# EasyEDA Pro project ProPrj_Thunder F722 Final_2024-11-16.epro, schematic Thunder F722 PCBA Low Cost
Board Name: Thunder F722 PCBA Low Cost; Create Date: 2024-11-16; Page Name: SCH_GIT_FULL; Project Name: Thunder F722 Final; Schematic Name: Thunder F722 PCBA Low Cost; Update Date: 2024-11-16; Add into BOM: yes; Company: TROPICAL FPV; Convert to PCB: yes; Date: 2024-11-15; Draw By: ALESSANDRO; REV: 1.2; Sheet: 1/1
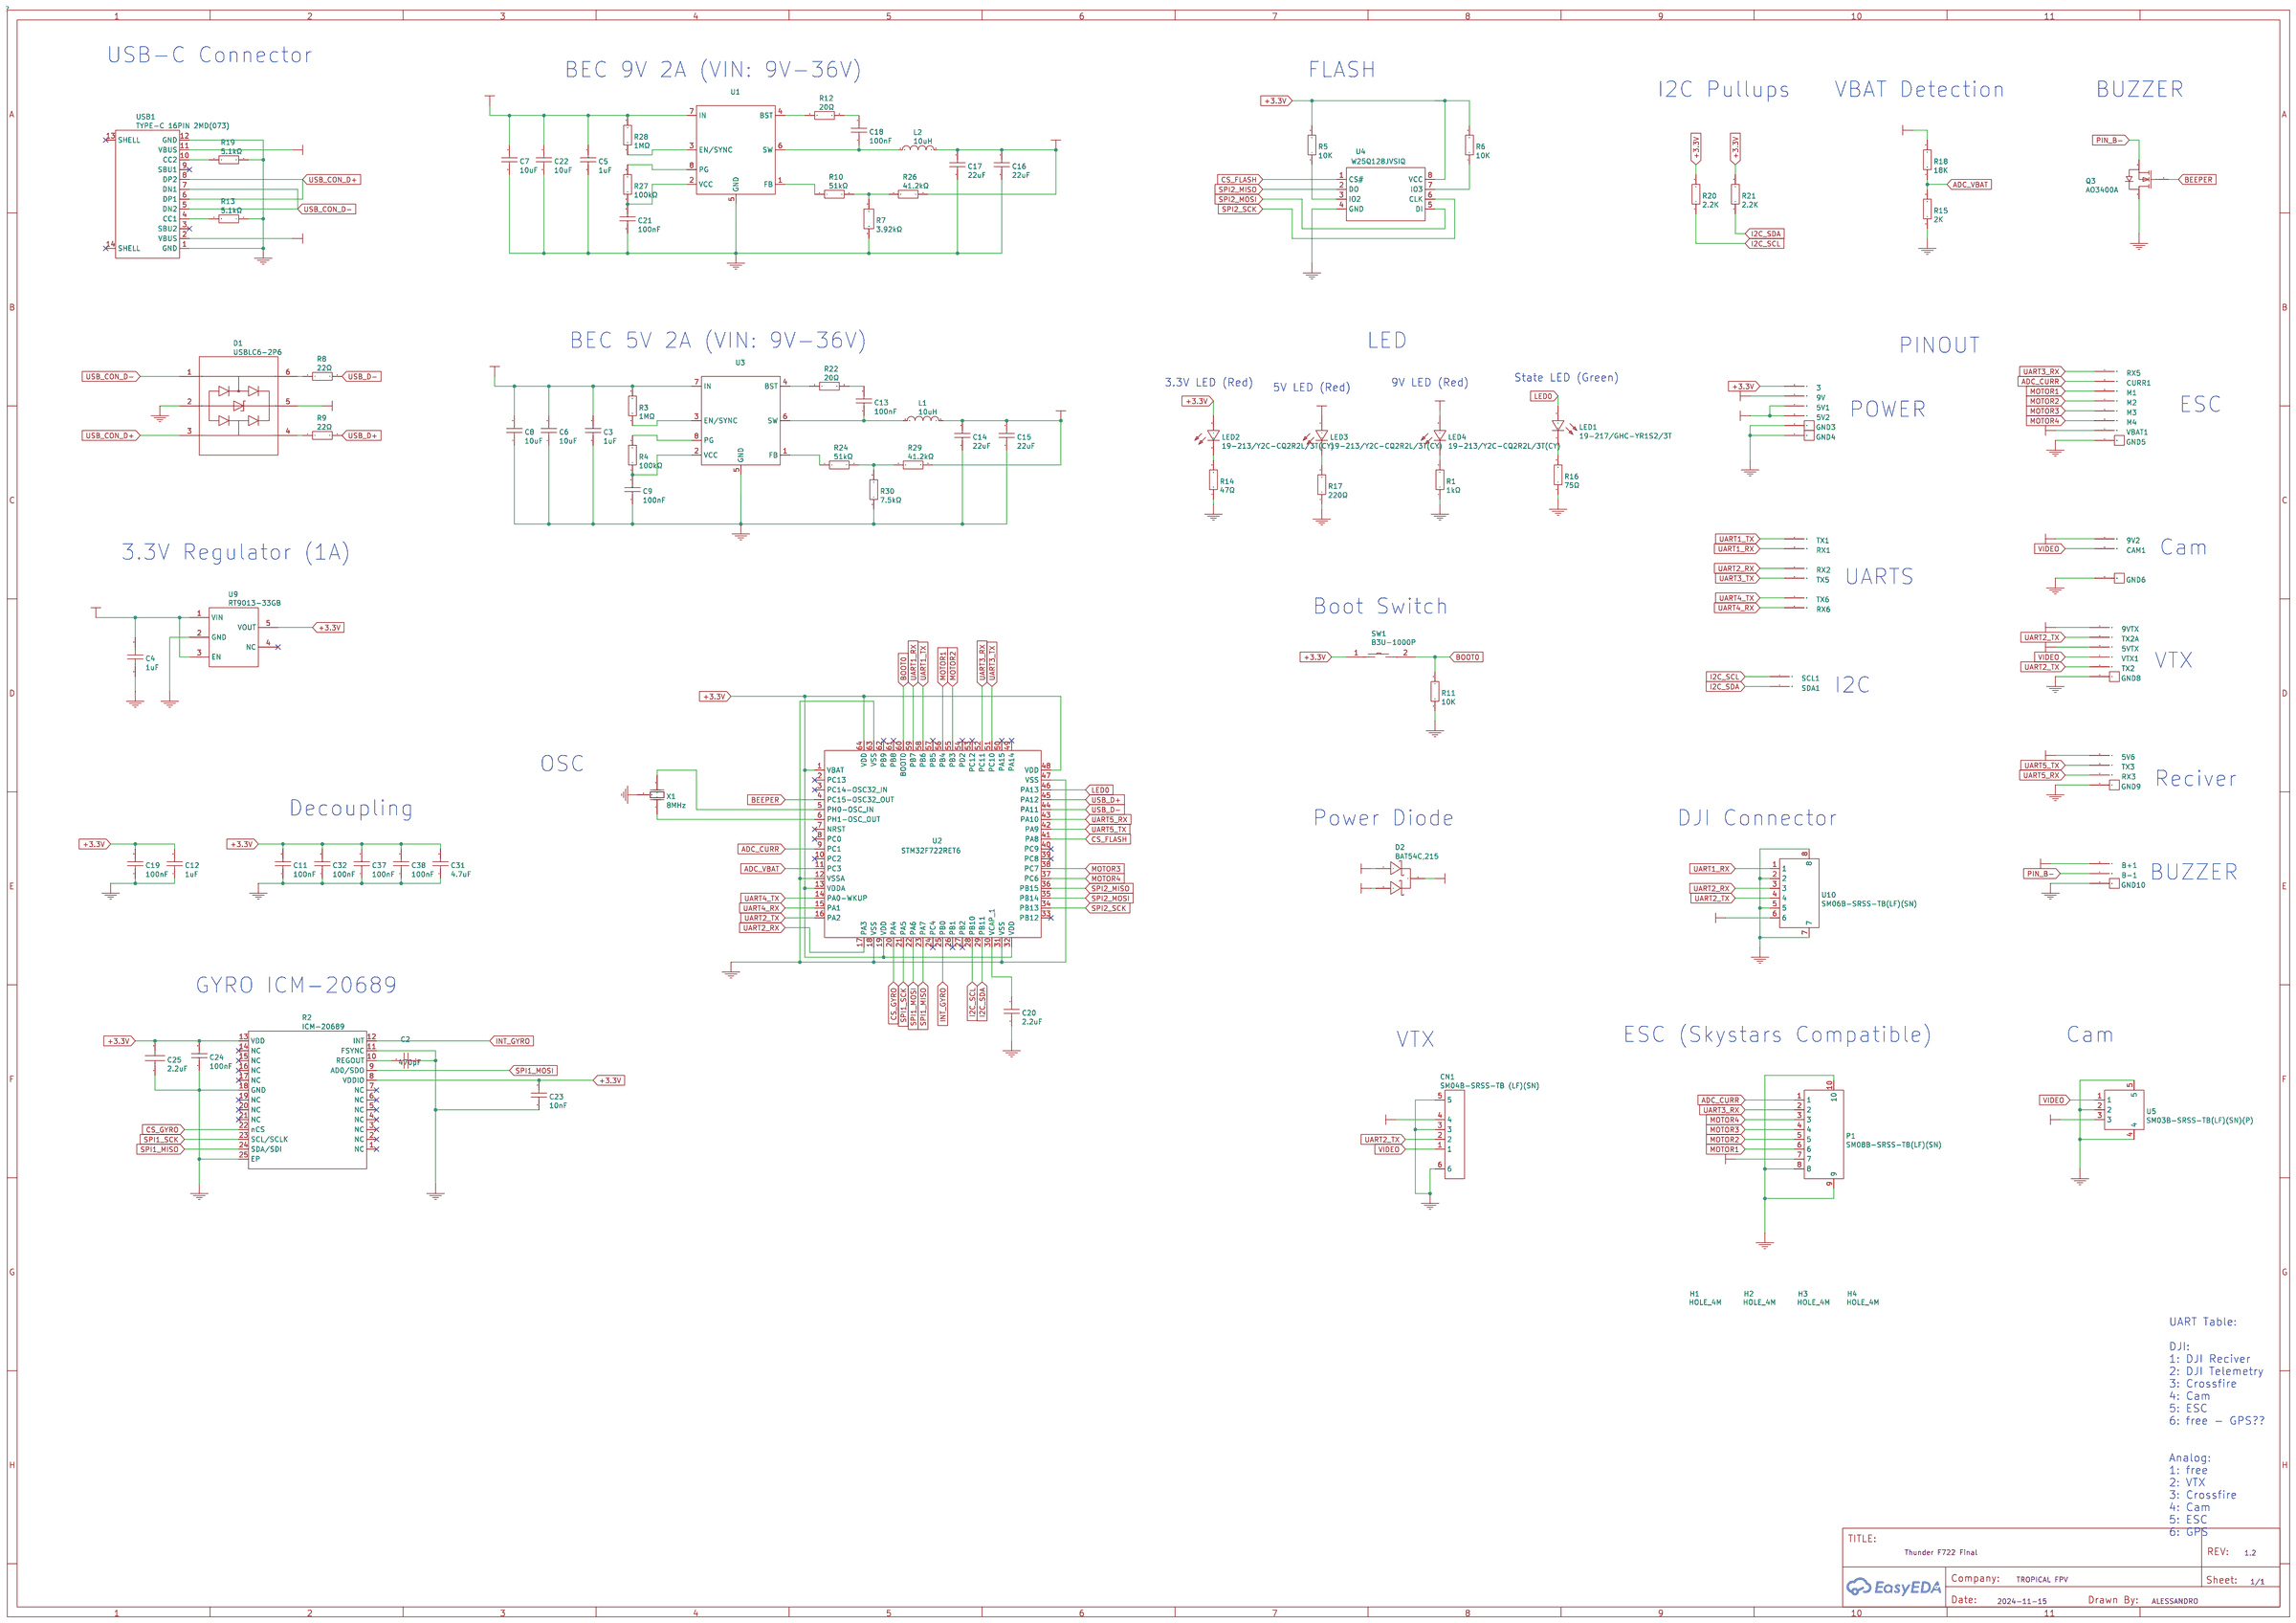
[diagram p0: schematic sheet]

## Parts
3  ROUND SOLDER PADS WITH HOLE 1.5MM X 2.5MM COPY  [ROUND SOLDER PADS WITH HOLE 1MM X 1.75MM]  (no BOM)
5V1  ROUND SOLDER PADS WITH HOLE 1.5MM X 2.5MM COPY  [ROUND SOLDER PADS WITH HOLE 1MM X 1.75MM]  (no BOM)
5V2  ROUND SOLDER PADS WITH HOLE 1.5MM X 2.5MM COPY  [ROUND SOLDER PADS WITH HOLE 1MM X 1.75MM]  (no BOM)
5V6  ROUND SOLDER PADS WITH HOLE 1.5MM X 2.5MM COPY  [ROUND SOLDER PADS WITH HOLE 1MM X 1.75MM]  (no BOM)
5VTX  ROUND SOLDER PADS WITH HOLE 1.5MM X 2.5MM COPY  [ROUND SOLDER PADS WITH HOLE 1MM X 1.75MM]  (no BOM)
9V  ROUND SOLDER PADS WITH HOLE 1.5MM X 2.5MM COPY  [ROUND SOLDER PADS WITH HOLE 1MM X 1.75MM]  (no BOM)
9V2  ROUND SOLDER PADS WITH HOLE 1.5MM X 2.5MM COPY  [ROUND SOLDER PADS WITH HOLE 1MM X 1.75MM]  (no BOM)
9VTX  ROUND SOLDER PADS WITH HOLE 1.5MM X 2.5MM COPY  [ROUND SOLDER PADS WITH HOLE 1MM X 1.75MM]  (no BOM)
B+1  ROUND SOLDER PADS WITH HOLE 1.5MM X 2.5MM COPY  [ROUND SOLDER PADS WITH HOLE 1MM X 1.75MM]  (no BOM)
B-1  ROUND SOLDER PADS WITH HOLE 1.5MM X 2.5MM COPY  [ROUND SOLDER PADS WITH HOLE 1MM X 1.75MM]  (no BOM)
C2  470pF  [C0402]
C3  1uF  [C0603]
C4  1uF  [C0402]
C5  1uF  [C0603]
C6  10uF  [C1206]
C7  10uF  [C1206]
C8  10uF  [C1206]
C9  100nF  [C0402]
C11  100nF  [C0402]
C12  1uF  [C0603]
C13  100nF  [C0402]
C14  22uF  [C1206]
C15  22uF  [C1206]
C16  22uF  [C1206]
C17  22uF  [C1206]
C18  100nF  [C0402]
C19  100nF  [C0402]
C20  2.2uF  [C0603]
C21  100nF  [C0402]
C22  10uF  [C1206]
C23  10nF  [C0402]
C24  100nF  [C0402]
C25  2.2uF  [C0402]
C31  4.7uF  [C0603]
C32  100nF  [C0402]
C37  100nF  [C0402]
C38  100nF  [C0402]
CAM1  ROUND SOLDER PADS WITH HOLE 1.5MM X 2.5MM COPY  [ROUND SOLDER PADS WITH HOLE 1MM X 1.75MM]  (no BOM)
CN1  SM04B-SRSS-TB (LF)(SN)  [CONN-SMD_4P-P1.00_SM04B-SRSS-TB-LF-SN]
CURR1  ROUND SOLDER PADS WITH HOLE 1.5MM X 2.5MM COPY  [ROUND SOLDER PADS WITH HOLE 1MM X 1.75MM]  (no BOM)
D1  USBLC6-2P6  [SOT-666-6_L1.6-W1.2-P0.50-LS1.6-BR]
D2  BAT54C,215  [SOT-23-3_L2.9-W1.6-P1.90-LS2.8-BR]
GND3  RECTANGLE SOLDER PADS WITH HOLE 1.5MM X 2.5MM  [RECTANGLE SOLDER PADS WITH HOLE 1.25MM X 1.75MM]  (no BOM)
GND4  RECTANGLE SOLDER PADS WITH HOLE 1.5MM X 2.5MM  [RECTANGLE SOLDER PADS WITH HOLE 1.25MM X 1.75MM]  (no BOM)
GND5  RECTANGLE SOLDER PADS WITH HOLE 1.5MM X 2.5MM  [RECTANGLE SOLDER PADS WITH HOLE 1.25MM X 1.75MM]  (no BOM)
GND6  RECTANGLE SOLDER PADS WITH HOLE 1.5MM X 2.5MM  [RECTANGLE SOLDER PADS WITH HOLE 1.25MM X 1.75MM]  (no BOM)
GND8  RECTANGLE SOLDER PADS WITH HOLE 1.5MM X 2.5MM  [RECTANGLE SOLDER PADS WITH HOLE 1.25MM X 1.75MM]  (no BOM)
GND9  RECTANGLE SOLDER PADS WITH HOLE 1.5MM X 2.5MM  [RECTANGLE SOLDER PADS WITH HOLE 1.25MM X 1.75MM]  (no BOM)
GND10  RECTANGLE SOLDER PADS WITH HOLE 1.5MM X 2.5MM  [RECTANGLE SOLDER PADS WITH HOLE 1.25MM X 1.75MM]  (no BOM)
H1  HOLE_4M  [HOLE_4MM]  (no BOM)
H2  HOLE_4M  [HOLE_4MM]  (no BOM)
H3  HOLE_4M  [HOLE_4MM]  (no BOM)
H4  HOLE_4M  [HOLE_4MM]  (no BOM)
L1  10uH  [IND-SMD_L4.4-W4.2_PSPMAA0412]
L2  10uH  [IND-SMD_L4.4-W4.2_PSPMAA0412]
LED1  19-217/GHC-YR1S2/3T  [LED0603-R-RD]
LED2  19-213/Y2C-CQ2R2L/3T(CY)  [LED0603-RD-YELLOW]
LED3  19-213/Y2C-CQ2R2L/3T(CY)  [LED0603-RD-YELLOW]
LED4  19-213/Y2C-CQ2R2L/3T(CY)  [LED0603-RD-YELLOW]
M1  ROUND SOLDER PADS WITH HOLE 1.5MM X 2.5MM COPY  [ROUND SOLDER PADS WITH HOLE 1MM X 1.75MM]  (no BOM)
M2  ROUND SOLDER PADS WITH HOLE 1.5MM X 2.5MM COPY  [ROUND SOLDER PADS WITH HOLE 1MM X 1.75MM]  (no BOM)
M3  ROUND SOLDER PADS WITH HOLE 1.5MM X 2.5MM COPY  [ROUND SOLDER PADS WITH HOLE 1MM X 1.75MM]  (no BOM)
M4  ROUND SOLDER PADS WITH HOLE 1.5MM X 2.5MM COPY  [ROUND SOLDER PADS WITH HOLE 1MM X 1.75MM]  (no BOM)
P1  SM08B-SRSS-TB(LF)(SN)  [CONN-TH_SM08B-SRSS-TB-LF-SN]
Q3  AO3400A  [SOT-23-3_L2.9-W1.6-P1.90-LS2.8-BR]
R1  1kΩ  [R0603]
R2  ICM-20689  [QFN-24_L4.0-W4.0-P0.50-TL-EP2.6]
R3  1MΩ  [R0603]
R4  100kΩ  [R0402]
R5  10K  [R0402]
R6  10K  [R0402]
R7  3.92kΩ  [R1206]
R8  22Ω  [R0402]
R9  22Ω  [R0402]
R10  51kΩ  [R0402]
R11  10K  [R0402]
R12  20Ω  [R0603]
R13  5.1kΩ  [R0402]
R14  47Ω  [R0402]
R15  2K  [R0402]
R16  75Ω  [R0603]
R17  220Ω  [R0402]
R18  18K  [R0402]
R19  5.1kΩ  [R0402]
R20  2.2K  [R0402]
R21  2.2K  [R0402]
R22  20Ω  [R0603]
R24  51kΩ  [R0402]
R26  41.2kΩ  [R1206]
R27  100kΩ  [R0402]
R28  1MΩ  [R0603]
R29  41.2kΩ  [R1206]
R30  7.5kΩ  [R0402]
RX1  ROUND SOLDER PADS WITH HOLE 1.5MM X 2.5MM COPY  [ROUND SOLDER PADS WITH HOLE 1MM X 1.75MM]  (no BOM)
RX2  ROUND SOLDER PADS WITH HOLE 1.5MM X 2.5MM COPY  [ROUND SOLDER PADS WITH HOLE 1MM X 1.75MM]  (no BOM)
RX3  ROUND SOLDER PADS WITH HOLE 1.5MM X 2.5MM COPY  [ROUND SOLDER PADS WITH HOLE 1MM X 1.75MM]  (no BOM)
RX5  ROUND SOLDER PADS WITH HOLE 1.5MM X 2.5MM COPY  [ROUND SOLDER PADS WITH HOLE 1MM X 1.75MM]  (no BOM)
RX6  ROUND SOLDER PADS WITH HOLE 1.5MM X 2.5MM COPY  [ROUND SOLDER PADS WITH HOLE 1MM X 1.75MM]  (no BOM)
SCL1  ROUND SOLDER PADS WITH HOLE 1.5MM X 2.5MM COPY  [ROUND SOLDER PADS WITH HOLE 1MM X 1.75MM]  (no BOM)
SDA1  ROUND SOLDER PADS WITH HOLE 1.5MM X 2.5MM COPY  [ROUND SOLDER PADS WITH HOLE 1MM X 1.75MM]  (no BOM)
SW1  B3U-1000P  [KEY-SMD_B3U-1000PM]
TX1  ROUND SOLDER PADS WITH HOLE 1.5MM X 2.5MM COPY  [ROUND SOLDER PADS WITH HOLE 1MM X 1.75MM]  (no BOM)
TX2  ROUND SOLDER PADS WITH HOLE 1.5MM X 2.5MM COPY  [ROUND SOLDER PADS WITH HOLE 1MM X 1.75MM]  (no BOM)
TX2A  ROUND SOLDER PADS WITH HOLE 1.5MM X 2.5MM COPY  [ROUND SOLDER PADS WITH HOLE 1MM X 1.75MM]  (no BOM)
TX3  ROUND SOLDER PADS WITH HOLE 1.5MM X 2.5MM COPY  [ROUND SOLDER PADS WITH HOLE 1MM X 1.75MM]  (no BOM)
TX5  ROUND SOLDER PADS WITH HOLE 1.5MM X 2.5MM COPY  [ROUND SOLDER PADS WITH HOLE 1MM X 1.75MM]  (no BOM)
TX6  ROUND SOLDER PADS WITH HOLE 1.5MM X 2.5MM COPY  [ROUND SOLDER PADS WITH HOLE 1MM X 1.75MM]  (no BOM)
U1  NO  [QFN-8_L3.0-W3.0-P0.65-BL]
U2  STM32F722RET6  [LQFP-64_L10.0-W10.0-P0.50-LS12.0-BL]
U3  NO  [QFN-8_L3.0-W3.0-P0.65-BL]
U4  W25Q128JVSIQ  [SOIC-8_L5.3-W5.3-P1.27-LS8.0-BL]
U5  SM03B-SRSS-TB(LF)(SN)(P)  [CONN-SMD_SM03B-SRSS-TB-LF-SN-P]
U9  RT9013-33GB  [SOT-23-5_L3.0-W1.7-P0.95-LS2.8-BR]
U10  SM06B-SRSS-TB(LF)(SN)  [CONN-SMD_SM06B-SRSS-TB(LF)(SN)]
USB1  TYPE-C 16PIN 2MD(073)  [USB-C-SMD_TYPE-C-6PIN-2MD-073]
VBAT1  ROUND SOLDER PADS WITH HOLE 1.5MM X 2.5MM COPY  [ROUND SOLDER PADS WITH HOLE 1MM X 1.75MM]  (no BOM)
VTX1  ROUND SOLDER PADS WITH HOLE 1.5MM X 2.5MM COPY  [ROUND SOLDER PADS WITH HOLE 1MM X 1.75MM]  (no BOM)
X1  8MHz  [OSC-SMD_3P-L3.2-W1.3-P1.20-L]

## Library data of the parts
3 5V1 5V2 5V6 5VTX 9V 9V2 9VTX B+1 B-1 CAM1 CURR1 M1-M4 RX1-RX3 RX5 RX6 SCL1 SDA1 TX1 TX2 TX2A TX3 TX5 TX6 VBAT1 VTX1 = ROUND SOLDER PADS WITH HOLE 1.5MM X 2.5MM COPY: Manufacturer Part: solderpad
C2 = 470pF: Supplier: LCSC; Manufacturer: FH(风华); Manufacturer Part: 0402B471K500NT; Supplier Part: C1537; JLCPCB Part Class: Basic Part; link: https://lcsc.com/eda_search?q=C1537&amp;%26type=1&amp;ref=editor
C3 C5 C12 = 1uF: Supplier: LCSC; Manufacturer Part: CL10A105KB8NNNC; Manufacturer: SAMSUNG; Supplier Part: C15849; JLCPCB Part Class: Basic
C4 = 1uF: Supplier: LCSC; Manufacturer: SAMSUNG; Manufacturer Part: CL05A105KA5NQNC; Supplier Part: C52923; JLCPCB Part Class: Basic
C6-C8 C22 = 10uF: Supplier: LCSC; Manufacturer Part: CL31A106KBHNNNE; Manufacturer: SAMSUNG; Supplier Part: C13585; JLCPCB Part Class: Basic
C9 C11 C13 C18 C19 C21 C24 C32 C37 C38 = 100nF: Supplier: LCSC; Manufacturer Part: CL05B104KO5NNNC; Manufacturer: SAMSUNG; Supplier Part: C1525; JLCPCB Part Class: Basic
C14-C17 = 22uF: Supplier: LCSC; Manufacturer Part: CL31A226KPHNNNE; Manufacturer: SAMSUNG(三星); Supplier Part: C5672; JLCPCB Part Class: Basic Part; link: https://lcsc.com/eda_search?q=C5672&amp;%26type=1&amp;ref=editor
C20 = 2.2uF: Supplier: LCSC; Manufacturer Part: CL10A225KO8NNNC; Manufacturer: SAMSUNG; Supplier Part: C23630; JLCPCB Part Class: Basic
C23 = 10nF: Supplier: LCSC; Manufacturer Part: CL05B103KB5NNNC; Manufacturer: SAMSUNG(三星); Supplier Part: C15195; JLCPCB Part Class: Basic Part; link: https://lcsc.com/eda_search?q=C15195&amp;%26type=1&amp;ref=editor
C25 = 2.2uF: Supplier: LCSC; Manufacturer Part: CL05A225MQ5NSNC; Manufacturer: SAMSUNG(三星); Supplier Part: C12530; JLCPCB Part Class: Basic Part; link: https://lcsc.com/eda_search?q=C12530&amp;%26type=1&amp;ref=editor
C31 = 4.7uF: Supplier: LCSC; Manufacturer Part: CL10A475KO8NNNC; Manufacturer: SAMSUNG; Supplier Part: C19666; JLCPCB Part Class: Basic
CN1 = SM04B-SRSS-TB (LF)(SN): Supplier: LCSC; Supplier Part: C160404; Manufacturer: JST; Manufacturer Part: SM04B-SRSS-TB(LF)(SN); JLCPCB Part Class: Extended Part; link: https://lcsc.com/eda_search?q=C160404&amp;%26type=1&amp;ref=editor
D1 = USBLC6-2P6: Supplier: LCSC; Manufacturer: STMicroelectronics; image: //image.lceda.cn/szlcsc/C15999.jpg; Supplier Part: C15999; JLCPCB Part Class: Extend
D2 = BAT54C,215: Supplier: LCSC; Manufacturer: Nexperia(安世); Supplier Part: C37704; JLCPCB Part Class: Basic Part; link: https://lcsc.com/eda_search?q=C37704&amp;%26type=1&amp;ref=editor
GND3-GND6 GND8-GND10 = RECTANGLE SOLDER PADS WITH HOLE 1.5MM X 2.5MM: Manufacturer Part: solderpad
H1-H4 = HOLE_4M
L1 L2 = 10uH: Supplier: LCSC; Supplier Part: C351093; Manufacturer: YJYCOIN(益嘉源); Manufacturer Part: YSPI0420-100M; JLCPCB Part Class: Extended Part; link: https://lcsc.com/eda_search?q=C351093&amp;%26type=1&amp;ref=editor
LED1 = 19-217/GHC-YR1S2/3T: Supplier: LCSC; Manufacturer: EVERLIGHT; image: //image.lceda.cn/szlcsc/C72043.jpg; Supplier Part: C72043; JLCPCB Part Class: Basic
LED2-LED4 = 19-213/Y2C-CQ2R2L/3T(CY): Supplier: LCSC; Manufacturer: EVERLIGHT(亿光); Supplier Part: C72038; JLCPCB Part Class: Basic Part
P1 = SM08B-SRSS-TB(LF)(SN): Supplier: LCSC; Supplier Part: C160407; Manufacturer: JST; JLCPCB Part Class: Extended Part; link: https://lcsc.com/eda_search?q=C160407&amp;%26type=1&amp;ref=editor
Q3 = AO3400A: Supplier: LCSC; Manufacturer: AOS; image: //image.lceda.cn/szlcsc/C20917.jpg; Supplier Part: C20917; JLCPCB Part Class: Basic
R1 = 1kΩ: Supplier: LCSC; Manufacturer: UNI-ROYAL(厚声); Manufacturer Part: 0603WAF1001T5E; Supplier Part: C21190; JLCPCB Part Class: Basic Part
R2 = ICM-20689: Supplier: LCSC; Supplier Part: C2649494; Manufacturer: TDK InvenSense(应美盛); JLCPCB Part Class: Extended Part; link: https://lcsc.com/eda_search?q=C2649494&amp;%26type=1&amp;ref=editor
R3 R28 = 1MΩ: Supplier: LCSC; Manufacturer: UNI-ROYAL(厚声); Manufacturer Part: 0603WAF1004T5E; Supplier Part: C22935; JLCPCB Part Class: Basic Part; link: https://lcsc.com/eda_search?q=C22935&amp;%26type=1&amp;ref=editor
R4 R27 = 100kΩ: Supplier: LCSC; Manufacturer: UNI-ROYAL(厚声); Manufacturer Part: 0402WGF1003TCE; Supplier Part: C25741; JLCPCB Part Class: Basic Part; link: https://lcsc.com/eda_search?q=C25741&amp;%26type=1&amp;ref=editor
R5 R6 R11 = 10K: Supplier: LCSC; Manufacturer: UniOhm; Manufacturer Part: 0402WGF1002TCE; Supplier Part: C25744; JLCPCB Part Class: Basic
R7 = 3.92kΩ: Supplier: LCSC; Supplier Part: C407270; Manufacturer: UNI-ROYAL(厚声); Manufacturer Part: 1206W4F3921T5E; JLCPCB Part Class: Extended Part
R8 R9 = 22Ω: Supplier: LCSC; Manufacturer: UNI-ROYAL(厚声); Manufacturer Part: 0402WGF220JTCE; Supplier Part: C25092; JLCPCB Part Class: Basic Part; link: https://lcsc.com/eda_search?q=C25092&amp;%26type=1&amp;ref=editor
R10 R24 = 51kΩ: Supplier: LCSC; Manufacturer: UNI-ROYAL(厚声); Manufacturer Part: 0402WGF5102TCE; Supplier Part: C25794; JLCPCB Part Class: Basic Part; link: https://lcsc.com/eda_search?q=C25794&amp;%26type=1&amp;ref=editor
R12 R22 = 20Ω: Supplier: LCSC; Manufacturer: UNI-ROYAL(厚声); Manufacturer Part: 0603WAF200JT5E; Supplier Part: C22950; JLCPCB Part Class: Basic Part; link: https://lcsc.com/eda_search?q=C22950&amp;%26type=1&amp;ref=editor
R13 R19 = 5.1kΩ: Supplier: LCSC; Manufacturer: UNI-ROYAL(厚声); Manufacturer Part: 0402WGF5101TCE; Supplier Part: C25905; JLCPCB Part Class: Basic Part; link: https://lcsc.com/eda_search?q=C25905&amp;%26type=1&amp;ref=editor
R14 = 47Ω: Supplier: LCSC; Manufacturer: UniOhm; Manufacturer Part: 0402WGF470JTCE; Supplier Part: C25118; JLCPCB Part Class: Basic
R15 = 2K: Supplier: LCSC; Manufacturer Part: 0402WGF2001TCE; Manufacturer: UniOhm; Supplier Part: C4109; JLCPCB Part Class: Basic
R16 = 75Ω: Supplier: LCSC; Manufacturer: UniOhm; Manufacturer Part: 0603WAF750JT5E; Supplier Part: C4275; JLCPCB Part Class: Basic
R17 = 220Ω: Supplier: LCSC; Manufacturer: UniOhm; Manufacturer Part: 0402WGF2200TCE; Supplier Part: C25091; JLCPCB Part Class: Basic
R18 = 18K: Supplier: LCSC; Manufacturer: UniOhm; Manufacturer Part: 0402WGF1802TCE; Supplier Part: C25762; JLCPCB Part Class: Basic
R20 R21 = 2.2K: Supplier: LCSC; Manufacturer: UniOhm; Manufacturer Part: 0402WGF2201TCE; Supplier Part: C25879; JLCPCB Part Class: Basic
R26 R29 = 41.2kΩ: Supplier: LCSC; Supplier Part: C323042; Manufacturer: FH(风华); Manufacturer Part: RS-06K4122FT; JLCPCB Part Class: Extended Part
R30 = 7.5kΩ: Supplier: LCSC; Manufacturer: UNI-ROYAL(厚声); Manufacturer Part: 0402WGF7501TCE; Supplier Part: C25918; JLCPCB Part Class: Basic Part; link: https://lcsc.com/eda_search?q=C25918&amp;%26type=1&amp;ref=editor
SW1 = B3U-1000P: Supplier: LCSC; Supplier Part: C231329; Manufacturer: OMRON(欧姆龙); JLCPCB Part Class: Extended Part; link: https://lcsc.com/eda_search?q=C231329&amp;%26type=1&amp;ref=editor
U1 U3 = NO: Supplier: LCSC; Supplier Part: C477821; Manufacturer: null; Manufacturer Part: MP9943GQ-Z; JLCPCB Part Class: Extended Part
U2 = STM32F722RET6: Supplier: LCSC; Supplier Part: C118207; Manufacturer: STMicroelectronics; JLCPCB Part Class: Extend
U4 = W25Q128JVSIQ: Supplier: LCSC; Manufacturer: WINBOND; Supplier Part: C97521; JLCPCB Part Class: Basic
U5 = SM03B-SRSS-TB(LF)(SN)(P): Supplier: LCSC; Supplier Part: C160403; Manufacturer: JST; Manufacturer Part: SM03B-SRSS-TB(LF)(SN); JLCPCB Part Class: Extended Part; link: https://lcsc.com/eda_search?q=C160403&amp;%26type=1&amp;ref=editor
U9 = RT9013-33GB: Supplier: LCSC; Manufacturer: RICHTEK; image: //image.lceda.cn/szlcsc/C47773.jpg; Supplier Part: C47773; JLCPCB Part Class: Extend
U10 = SM06B-SRSS-TB(LF)(SN): Supplier: LCSC; Supplier Part: C160405; Manufacturer: JST Sales America
USB1 = TYPE-C 16PIN 2MD(073): Supplier: LCSC; Supplier Part: C2765186; Manufacturer: SHOU HAN(首韩); JLCPCB Part Class: Extended Part; link: https://lcsc.com/eda_search?q=C2765186&amp;%26type=1&amp;ref=editor
X1 = 8MHz: Supplier: LCSC; Supplier Part: C341522; Manufacturer: muRata(村田); Manufacturer Part: CSTNE8M00G550000R0; JLCPCB Part Class: Extended Part; LINK: https://pt.aliexpress.com/item/1005003999625742.html?spm=a2g0o.detail.pcDetailTopMoreOtherSeller.1.7294r6u0r6u0H8&amp;gps-id=pcDetailTopMoreOtherSeller&amp;scm=1007.14452.396806.0&amp;scm_id=1007.14452.396806.0&amp;s

## Nets
+3.3V: 3.1(pad) C11.2 C12.2 C19.2 C23.2 C24.2 C25.2 C31.2 C32.2 C37.2 C38.2 LED2.2(A) R2.8(VDDIO) R2.13(VDD) R5.2 R6.2 R20.2 R21.2 SW1.1 U2.1(VBAT) U2.13(VDDA) U2.19(VDD) U2.32(VDD) U2.48(VDD) U2.64(VDD) U4.8(VCC) U9.5(VOUT)
+5V: 5V1.1(pad) 5V2.1(pad) 5V6.1(pad) 5VTX.1(pad) B+1.1(pad) C4.2 CN1.4 D2.3(K) LED3.2(A) U9.1(VIN) U9.3(EN)
+5VBAT: C14.2 C15.2 D2.1(A) L1.2 R29.2
+5VBUS: D1.5(VBUS) D2.2(A) USB1.2(VBUS) USB1.11(VBUS)
+9V: 9V.1(pad) 9V2.1(pad) 9VTX.1(pad) C16.2 C17.2 L2.2 LED4.2(A) R26.2 U5.3 U10.6
GND: C2.1 C3.1 C4.1 C5.1 C6.1 C7.1 C8.1 C9.1 C11.1 C12.1 C14.1 C15.1 C16.1 C17.1 C19.1 C20.1 C21.1 C22.1 C23.1 C24.1 C25.1 C31.1 C32.1 C37.1 C38.1 CN1.3 CN1.5 CN1.6 D1.2(GND) GND3.1(pad) GND4.1(pad) GND5.1(pad) GND6.1(pad) GND8.1(pad) GND9.1(pad) GND10.1(pad) P1.8 P1.9 P1.10 Q3.3(D) R1.1 R2.11(FSYNC) R2.18(GND) R2.25(EP) R7.2 R11.1 R13.1 R14.1 R15.1 R16.1 R17.1 R19.2 R30.1 U1.5(GND) U2.12(VSSA) U2.18(VSS) U2.31(VSS) U2.47(VSS) U2.63(VSS) U3.5(GND) U4.4(GND) U5.2 U5.4 U5.5 U9.2(GND) U10.2 U10.5 U10.7 U10.8 USB1.1(GND) USB1.12(GND) X1.2(GND)
+VLIPO: C3.2 C5.2 C6.2 C7.2 C8.2 C22.2 P1.7 R3.2 R18.2 R28.2 U1.7(IN) U3.7(IN) VBAT1.1(pad)
ADC_CURR: CURR1.1(pad) P1.1 U2.9(PC1)
ADC_VBAT: R15.2 R18.1 U2.11(PC3)
BEEPER: Q3.1(G) U2.4(PC15-OSC32_OUT)
BOOT0: R11.2 SW1.2 U2.60(BOOT0)
CS_FLASH: U2.41(PA8) U4.1(CS#)
CS_GYRO: R2.22(nCS) U2.20(PA4)
I2C_SCL: R20.1 SCL1.1(pad) U2.28(PB10)
I2C_SDA: R21.1 SDA1.1(pad) U2.29(PB11)
INT_GYRO: R2.12(INT) U2.25(PB0)
LED0: LED1.1(A) U2.46(PA13)
MOTOR1: M1.1(pad) P1.6 U2.56(PB4)
MOTOR2: M2.1(pad) P1.5 U2.55(PB3)
MOTOR3: M3.1(pad) P1.4 U2.38(PC7)
MOTOR4: M4.1(pad) P1.3 U2.37(PC6)
PIN_B-: B-1.1(pad) Q3.2(S)
SPI1_MISO: R2.24(SDA/SDI) U2.23(PA7)
SPI1_MOSI: R2.9(AD0/SDO) U2.22(PA6)
SPI1_SCK: R2.23(SCL/SCLK) U2.21(PA5)
SPI2_MISO: U2.36(PB15) U4.2(DO)
SPI2_MOSI: U2.35(PB14) U4.5(DI)
SPI2_SCK: U2.34(PB13) U4.6(CLK)
UART1_RX: RX1.1(pad) U2.59(PB7) U10.1
UART1_TX: TX1.1(pad) U2.58(PB6)
UART2_RX: RX2.1(pad) U2.17(PA3) U10.3
UART2_TX: CN1.2 TX2.1(pad) TX2A.1(pad) U2.16(PA2) U10.4
UART3_RX: P1.2 RX5.1(pad) U2.52(PC11)
UART3_TX: TX5.1(pad) U2.51(PC10)
UART4_RX: RX6.1(pad) U2.15(PA1)
UART4_TX: TX6.1(pad) U2.14(PA0-WKUP)
UART5_RX: RX3.1(pad) U2.43(PA10)
UART5_TX: TX3.1(pad) U2.42(PA9)
USB_CON_D+: D1.3(I/O2) USB1.6(DP1) USB1.8(DP2)
USB_CON_D-: D1.1(I/O1) USB1.5(DN2) USB1.7(DN1)
USB_D+: R9.2 U2.45(PA12)
USB_D-: R8.2 U2.44(PA11)
VIDEO: CAM1.1(pad) CN1.1 U5.1 VTX1.1(pad)
$1N9: R5.1 U4.3(IO2)
$1N10: R6.1 U4.7(IO3)
$1N26: LED4.1(C) R1.2
$1N27: LED3.1(C) R17.2
$1N39: LED1.2(C) R16.2
$1N43: LED2.1(C) R14.2
$1N92: U2.6(PH1-OSC_OUT) X1.1(OSC1)
$1N93: U2.5(PH0-OSC_IN) X1.3(OSC2)
$1N96: C20.2 U2.30(VCAP_1)
$1N110: D1.6(I/O1) R8.1
$1N111: D1.4(I/O2) R9.1
$1N118: C2.2 R2.10(REGOUT)
$1N127: R19.1 USB1.10(CC2)
$1N128: R13.2 USB1.4(CC1)
$1N143: R3.1 U3.3(EN/SYNC)
$1N144: R4.2 U3.8(PG)
$1N145: C9.2 R4.1 U3.2(VCC)
$1N146: R22.1 U3.4(BST)
$1N147: C13.2 R22.2
$1N148: C13.1 L1.1 U3.6(SW)
$1N151: R24.2 R29.1 R30.2
$1N153: R24.1 U3.1(FB)
$1N154: R10.1 U1.1(FB)
$1N156: R7.1 R10.2 R26.1
$1N158: C18.1 L2.1 U1.6(SW)
$1N159: C18.2 R12.2
$1N160: R12.1 U1.4(BST)
$1N162: C21.2 R27.1 U1.2(VCC)
$1N163: R27.2 U1.8(PG)
$1N164: R28.1 U1.3(EN/SYNC)

Not connected (* = marked no-connect by the designer): R2 1(NC)* 2(NC)* 3(NC)* 4(NC)* 5(NC)* 6(NC)* 7(NC)* 14(NC)* 15(NC)* 16(NC)* 17(NC)* 19(NC)* 20(NC)* 21(NC)*; U2 2(PC13)* 3(PC14-OSC32_IN)* 7(NRST)* 8(PC0)* 10(PC2)* 24(PC4)* 26(PB1)* 27(PB2)* 33(PB12)* 39(PC8)* 40(PC9)* 49(PA14)* 50(PA15)* 53(PC12)* 54(PD2)* 57(PB5)* 61(PB8)* 62(PB9)*; U9 4(NC)*; USB1 3(SBU2)* 9(SBU1)* 13(SHELL)* 14(SHELL)*

## Notes on the sheet
- USB-C Connector
- BEC 9V 2A (VIN: 9V-36V)
- FLASH
- I2C Pullups
- VBAT Detection
- BUZZER
- BEC 5V 2A (VIN: 9V-36V)
- LED
- PINOUT
- 3.3V LED (Red)
- 9V LED (Red)
- State LED (Green)
- 5V LED (Red)
- POWER
- ESC
- 3.3V Regulator (1A)
- Cam
- UARTS
- Boot Switch
- VTX
- I2C
- OSC
- Reciver
- Decoupling
- Power Diode
- DJI Connector
- BUZZER
- GYRO ICM-20689
- VTX
- ESC (Skystars Compatible)
- Cam
- UART Table:
  DJI:
  1: DJI Reciver
  2: DJI Telemetry
  3: Crossfire
  4: Cam
  5: ESC
  6: free - GPS??
  Analog:
  1: free
  2: VTX
  3: Crossfire
  4: Cam
  5: ESC
  6: GPS
